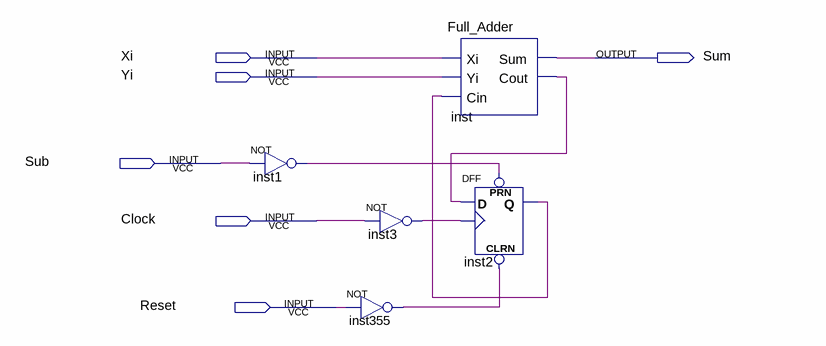
[diagram p0: schematic sheet]
// Quartus schematic SerialAdder.bdf as structural Verilog: 5 symbols, 6 pins
module SerialAdder (
  input  Xi,
  input  Yi,
  input  Sub,
  input  Clock,
  input  Reset,
  output Sum
);

  wire inst1_out, inst2_q, inst3_out, inst355_out, inst_cout;

  not inst1 (inst1_out, Sub);
  not inst355 (inst355_out, Reset);
  not inst3 (inst3_out, Clock);
  Full_Adder inst (.Xi(Xi), .Yi(Yi), .Cin(inst2_q), .Sum(Sum), .Cout(inst_cout));
  DFF inst2 (.CLRN(inst355_out), .CLK(inst3_out), .D(inst_cout), .PRN(inst1_out), .Q(inst2_q));
endmodule
